# EAGLE design pcf1306p-SMD (EAGLE 6.5.0)
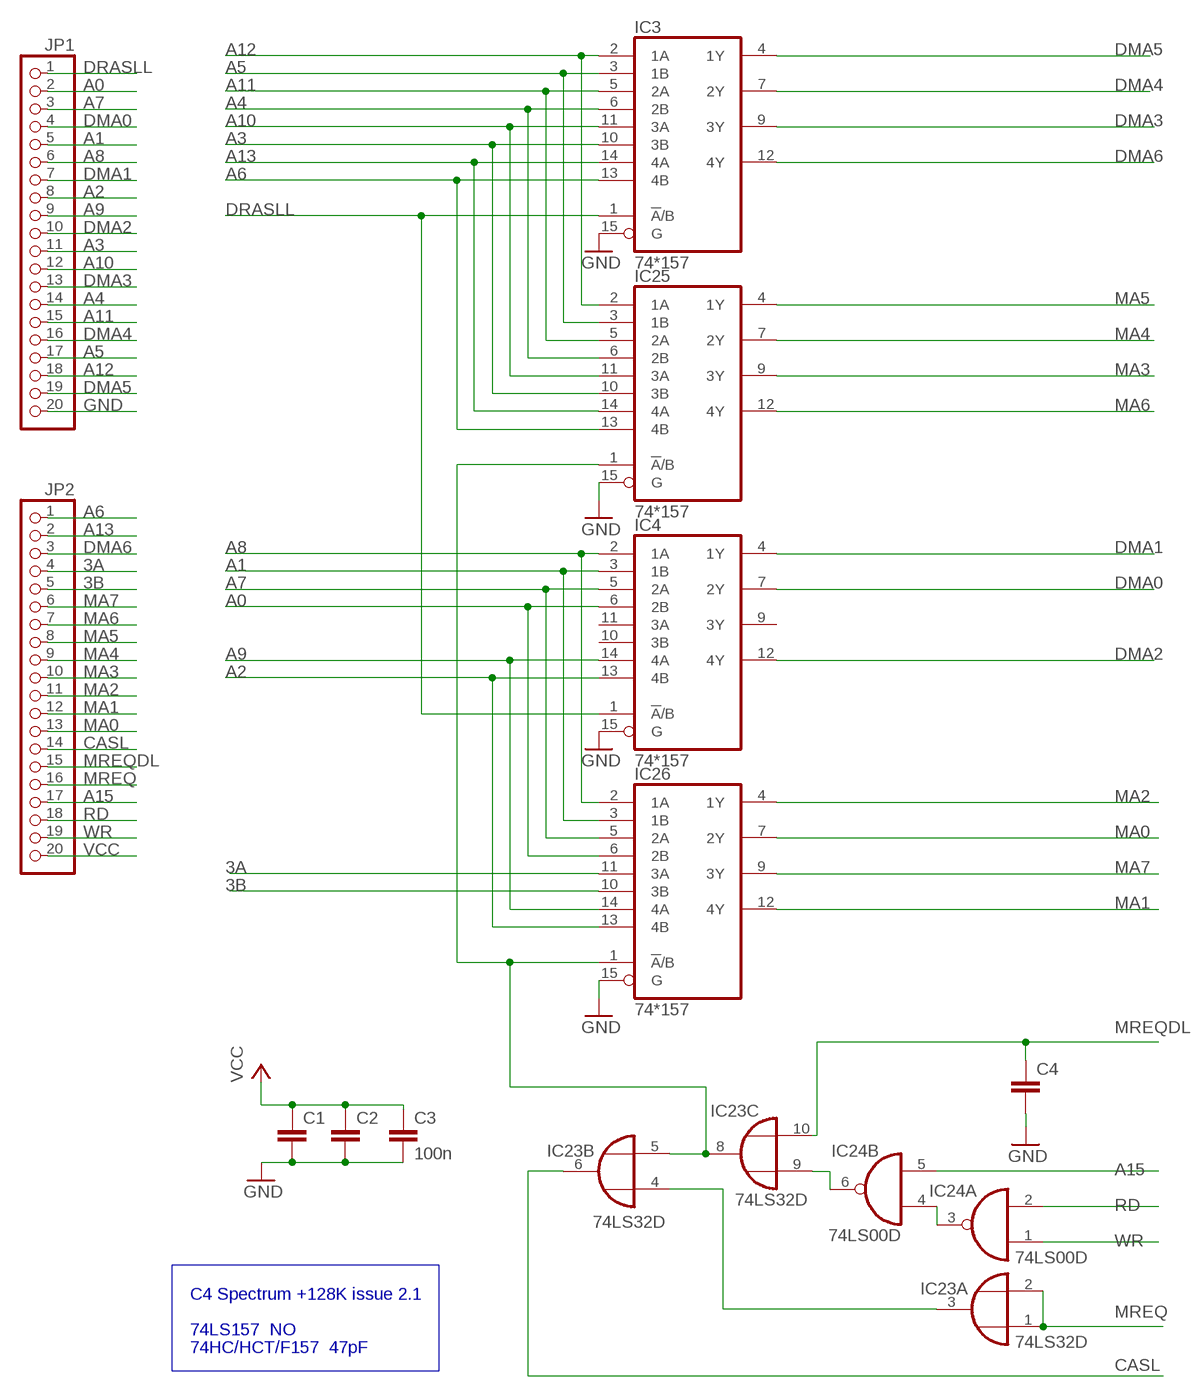
[diagram p0: schematic, sheet 1]

## Parts
C1  C-EUC0603  [C0603]
C2  C-EUC0603  [C0603]
C3  100n  C-EUC0603  [C0603]
C4  C-EUC0805  [C0805]
IC3  74*157  74LS157D  [SO16]
IC4  74*157  74LS157D  [SO16]
IC23  74LS32D  [SO14]
IC24  74LS00D  [SO14]
IC25  74*157  74LS157D  [SO16]
IC26  74*157  74LS157D  [SO16]
JP1  PINHD-1X20  [1X20]
JP2  PINHD-1X20  [1X20]

## Nets
3A: IC26.11(3A) JP2.4
3B: IC26.10(3B) JP2.5
A0: IC4.6(2B) IC26.6(2B) JP1.2
A1: IC4.3(1B) IC26.3(1B) JP1.5
A2: IC4.13(4B) IC26.13(4B) JP1.8
A3: IC3.10(3B) IC25.10(3B) JP1.11
A4: IC3.6(2B) IC25.6(2B) JP1.14
A5: IC3.3(1B) IC25.3(1B) JP1.17
A6: IC3.13(4B) IC25.13(4B) JP2.1
A7: IC4.5(2A) IC26.5(2A) JP1.3
A8: IC4.2(1A) IC26.2(1A) JP1.6
A9: IC4.14(4A) IC26.14(4A) JP1.9
A10: IC3.11(3A) IC25.11(3A) JP1.12
A11: IC3.5(2A) IC25.5(2A) JP1.15
A12: IC3.2(1A) IC25.2(1A) JP1.18
A13: IC3.14(4A) IC25.14(4A) JP2.2
A15: IC24.5(B:I1) JP2.17
CASL: IC23.6(B:O) JP2.14
DMA0: IC4.7(2Y) JP1.4
DMA1: IC4.4(1Y) JP1.7
DMA2: IC4.12(4Y) JP1.10
DMA3: IC3.9(3Y) JP1.13
DMA4: IC3.7(2Y) JP1.16
DMA5: IC3.4(1Y) JP1.19
DMA6: IC3.12(4Y) JP2.3
DRASLL: IC3.1(!A!/B) IC4.1(!A!/B) JP1.1
GND: C1.2 C2.2 C3.2 C4.2 IC3.15(G) IC4.15(G) IC25.15(G) IC26.15(G) JP1.20
MA0: IC26.7(2Y) JP2.13
MA1: IC26.12(4Y) JP2.12
MA2: IC26.4(1Y) JP2.11
MA3: IC25.9(3Y) JP2.10
MA4: IC25.7(2Y) JP2.9
MA5: IC25.4(1Y) JP2.8
MA6: IC25.12(4Y) JP2.7
MA7: IC26.9(3Y) JP2.6
MREQ: IC23.1(A:I0) IC23.2(A:I1) JP2.16
MREQDL: C4.1 IC23.10(C:I1) JP2.15
N$3: IC23.3(A:O) IC23.4(B:I0)
N$4: IC23.5(B:I1) IC23.8(C:O) IC25.1(!A!/B) IC26.1(!A!/B)
N$7: IC24.3(A:O) IC24.4(B:I0)
N$8: IC23.9(C:I0) IC24.6(B:O)
RD: IC24.2(A:I1) JP2.18
VCC: C1.1 C2.1 C3.1 JP2.20
WR: IC24.1(A:I0) JP2.19
Unconnected: IC4.9(3Y) IC4.10(3B) IC4.11(3A) IC23.11(D:O) IC23.12(D:I0) IC23.13(D:I1) IC24.8(C:O) IC24.9(C:I0) IC24.10(C:I1) IC24.11(D:O) IC24.12(D:I0) IC24.13(D:I1)

## Buses
B$1

## Notes on the sheet
- C4 Spectrum +128K issue 2.1
- 74LS157  NO
- 74HC/HCT/F157  47pF

## Power pins joined to a net without a drawn wire
GND: IC3.8(GND) IC4.8(GND) IC23.7(P:GND) IC24.7(P:GND) IC25.8(GND) IC26.8(GND)
VCC: IC3.16(VCC) IC4.16(VCC) IC23.14(P:VCC) IC24.14(P:VCC) IC25.16(VCC) IC26.16(VCC)

## Library data of the parts
C1-C4 = rcl:C-EU: CAPACITOR, European symbol
IC3 IC4 IC25 IC26 = 74xx-eu:74*157: Quadruple 2-line to 1-line data SELECTOR/MULTIPLEXER
IC23 = 74xx-eu:74*32: Quad 2-input OR gate
IC24 = 74xx-eu:74*00: Quad 2-input NAND gate
JP1 JP2 = pinhead:PINHD-1X20: PIN HEADER

## Board
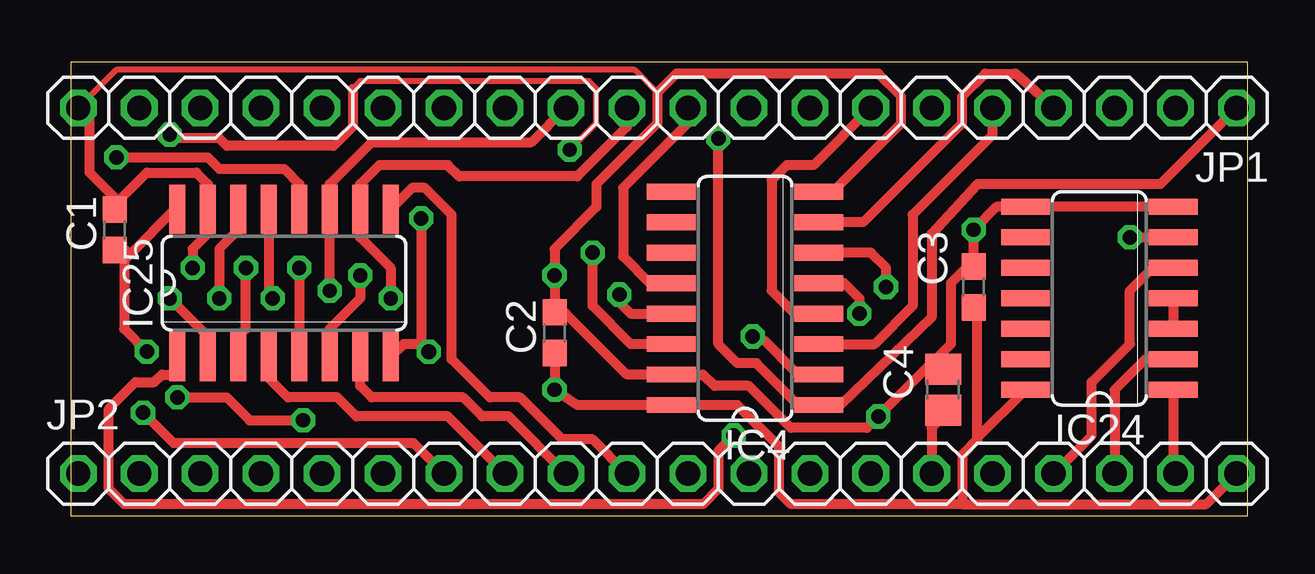
[diagram p1: board, top side]
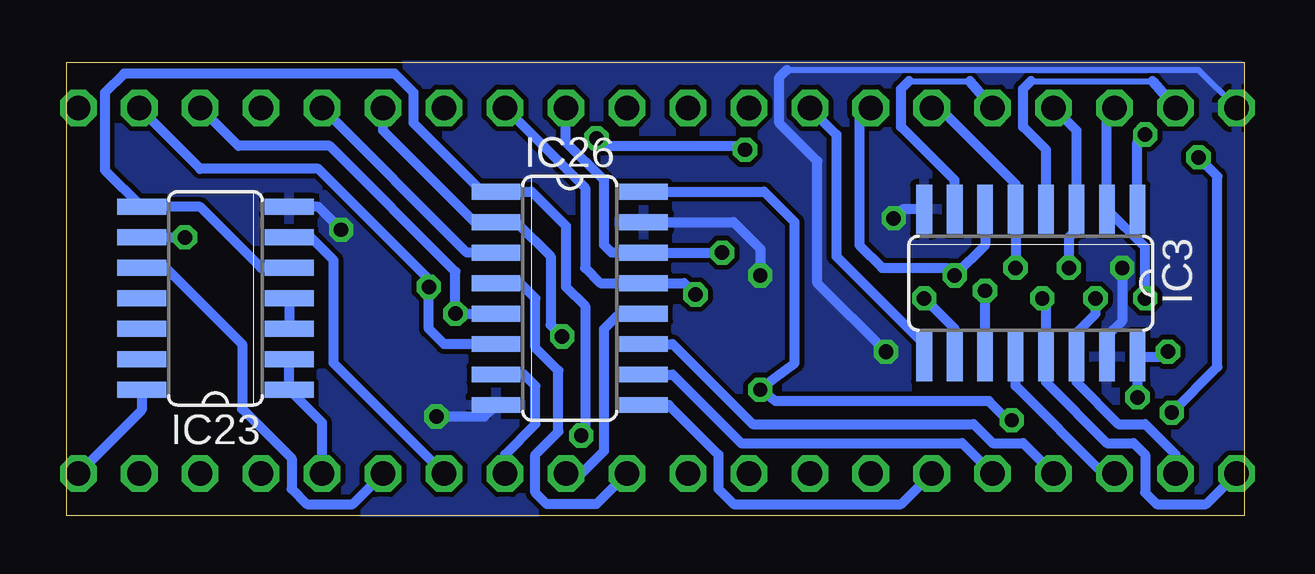
[diagram p2: board, bottom side, seen from below]

No outline drawn. Coordinates in mm, seen from the top.
Copper layers (1*16): Top 0.035mm / dielectric 1.5mm / Bottom 0.035mm
Design rules "default": minimum track width 10mil, minimum drill 24mil, track to track 8mil, track to pad 8mil, pad to pad 8mil, via to via 8mil, smd to smd 8mil, copper to edge 40mil, drill to drill 8mil, minimum pad ring 10mil, minimum via ring 8mil, stop-mask expansion 4mil, vias tented up to drill 0mil, thermal gap 10mil
Milling: 4 lines

### Footprints (pad centres in the part's own frame; a part is rotated, then mirrored left to right if it is on the bottom)
C0603 = smd 1.1 x 1: 1 -0.85,0; 2 0.85,0
C0805 = smd 1.3 x 1.5: 1 -0.85,0; 2 0.85,0
SO16 = smd 0.66 x 2.032: 1 -4.445,-3.073; 2 -3.175,-3.073; 3 -1.905,-3.073; 4 -0.635,-3.073; 5 0.635,-3.073; 6 1.905,-3.073; 7 3.175,-3.073; 8 4.445,-3.073; 9 4.445,3.073; 10 3.175,3.073; 11 1.905,3.073; 12 0.635,3.073; 13 -0.635,3.073; 14 -1.905,3.073; 15 -3.175,3.073; 16 -4.445,3.073
SO14 = smd 0.66 x 2.032: 1 -3.81,-3.073; 2 -2.54,-3.073; 3 -1.27,-3.073; 4 0,-3.073; 5 1.27,-3.073; 6 2.54,-3.073; 7 3.81,-3.073; 8 3.81,3.073; 9 2.54,3.073; 10 1.27,3.073; 11 0,3.073; 12 -1.27,3.073; 13 -2.54,3.073; 14 -3.81,3.073
1X20 = drill 1.016 octagon: 1 -24.13,0; 2 -21.59,0; 3 -19.05,0; 4 -16.51,0; 5 -13.97,0; 6 -11.43,0; 7 -8.89,0; 8 -6.35,0; 9 -3.81,0; 10 -1.27,0; 11 1.27,0; 12 3.81,0; 13 6.35,0; 14 8.89,0; 15 11.43,0; 16 13.97,0; 17 16.51,0; 18 19.05,0; 19 21.59,0; 20 24.13,0

### Placement (x,y rotation side)
C1  1.84,11.91 90 top
C2  20.16,7.62 90 top
C3  37.62,9.53 90 top
C4  36.35,5.24 90 top
IC3  8.89,9.68 180 bottom
IC4  28.1,9.05 90 top
IC23  42.86,9.05 90 bottom
IC24  42.86,9.05 90 top
IC25  8.89,9.68 0 top
IC26  28.1,9.05 270 bottom
JP1  24.45,16.99 180 top
JP2  24.45,1.75 0 top

### Tracks (layer width: path | path; a pad name or v marks a point on that pad's centre or on a via)
3A
  Bottom 0.406: IC26.11 23.81,7.14 20.48,3.81 11.27,3.81 10.48,3.02 9.21,3.02 JP2.4
3B
  Bottom 0.406: IC26.10 23.81,5.87 20.95,3.02 11.75,3.02 JP2.5
A0  (via drill 0.6)
  Top 0.406: v33.97,9.53 33.97,10.32 33.34,10.95 IC4.6
  Bottom 0.406: IC26.6 33.34,7.14 33.97,7.78 v33.97,9.53 33.97,9.84 38.58,14.45 43.5,14.45 JP1.2
A1
  Top 0.406: IC4.3 33.5,7.14 35.08,8.73 35.08,12.54 38.42,15.88 JP1.5
  Bottom 0.406: IC26.3 32.38,10.95 JP1.5
A2  (via drill 0.6)
  Top 0.406: v22.86,9.21 22.86,8.89 23.34,8.41 IC4.13
  Bottom 0.406: JP1.8 27.46,13.65 27.46,10.32 26.83,9.68 IC26.13 23.34,9.68 v22.86,9.21
A3  (via drill 0.6)
  Top 0.406: v13.34,9.05 13.34,10.32 12.06,11.59 IC25.10 12.06,13.81 12.86,14.61 15.72,14.61 16.19,14.13 21.11,14.13 23.18,16.19 JP1.11
  Bottom 0.406: v13.34,9.05 12.06,7.78 IC3.10
A4  (via drill 0.6)
  Top 0.406: v12.06,10 12.06,9.05 10.79,7.78 IC25.6
  Bottom 0.406: IC3.6 10.79,11.27 v12.06,10 12.38,10.32 15.08,10.32 16.03,11.27 16.03,16.51 JP1.14
A5  (via drill 0.6)
  Top 0.406: IC25.3 6.99,7.46 7.3,7.78 v7.3,10.32
  Bottom 0.406: v7.3,10.32 7.3,11.59 6.99,11.91 IC3.3 6.99,16.03 JP1.17
A6  (via drill 0.6)
  Top 0.406: IC25.13 8.26,9.21 v8.41,9.05
  Bottom 0.406: v8.41,9.05 8.26,8.89 IC3.13 8.26,5.56 5.71,3.02 4.6,3.02 4.13,2.54 4.13,0.95 3.65,0.48 1.59,0.48 JP2.1
A7  (via drill 0.6)
  Top 0.406: IC4.5 32.23,9.68 32.86,9.05 v32.86,8.41
  Bottom 0.406: JP1.3 41.91,15.4 38.1,15.4 32.86,10.16 v32.86,8.41 IC26.5
A8  (via drill 0.6)
  Top 0.406: IC4.2 30.32,5.87 28.89,7.3 28.57,7.3 v28.42,7.46
  Bottom 0.406: JP1.6 35.88,16.03 32.07,12.22 IC26.2 30.32,12.22 28.89,10.79 28.89,7.94 v28.42,7.46
A9  (via drill 0.6)
  Top 0.406: IC4.14 23.34,7.14 21.75,8.73 v21.75,10.95
  Bottom 0.406: v21.75,10.95 IC26.14 26.35,10.95 26.67,11.27 26.67,13.97 28.26,15.56 JP1.9
A10  (via drill 0.6)
  Top 0.406: v10.79,9.37 IC25.11 10.79,13.81 12.54,15.56 19.21,15.56 JP1.12
  Bottom 0.406: IC3.11 v10.79,9.37
A11  (via drill 0.6)
  Top 0.406: v9.53,10.32 IC25.5
  Bottom 0.406: v9.53,10.32 IC3.5 9.53,13.81 12.7,16.99 JP1.15
A12  (via drill 0.6)
  Top 0.406: IC25.2 5.71,7.46 v4.13,9.05
  Bottom 0.406: v4.13,9.05 4.13,11.17 IC3.2 5.71,16.67 JP1.18
A13  (via drill 0.6)
  Top 0.406: IC25.14 6.99,11.91 6.19,11.11 v6.19,9.05
  Bottom 0.406: v6.19,9.05 6.19,8.41 6.99,7.62 IC3.14 6.99,5.56 5.24,3.81 4.13,3.81 2.86,2.54 JP2.2
A15
  Top 0.406: JP2.17 42.55,3.33 42.55,5.56 44.13,7.14 44.13,9.37 45.09,10.32 IC24.5
CASL
  Bottom 0.406: JP2.14 37.94,6.35 37.94,10.64 38.89,11.59 IC23.6
DMA0
  Top 0.406: JP1.4 39.37,18.41 38.1,18.41 37.15,17.46 37.15,16.35 33.02,12.22 IC4.7
DMA1
  Top 0.406: JP1.7 30.96,14.61 29.84,14.61 29.21,13.97 29.21,9.37 30.16,8.41 IC4.4
DMA2
  Top 0.406: JP1.10 25.72,16.35 23.02,13.65 23.02,10.79 24.13,9.68 IC4.12
DMA3
  Bottom 0.406: JP1.13 16.99,15.88 16.99,10.79 13.34,7.14 IC3.9
DMA4
  Bottom 0.254: 13.97,18.1 11.43,18.1
  Bottom 0.406: IC3.7 12.06,13.97 14.29,16.19 14.29,17.78 13.97,18.1 | 11.43,18.1 JP1.16
DMA5
  Bottom 0.254: 8.89,18.1 3.81,18.1
  Bottom 0.406: IC3.4 8.26,15.24 9.21,16.19 9.21,17.78 8.89,18.1 | 3.81,18.1 JP1.19
DMA6
  Bottom 0.406: JP2.3 5.87,1.75 9.53,5.4 IC3.12
DRASLL  (via drill 0.6)
  Top 0.254: 11.75,17.78 12.06,18.1 21.59,18.1 21.91,17.78 21.91,16.35 v20.8,15.24
  Top 0.406: JP1.1 45.4,13.81 37.78,13.81 35.88,11.75 35.88,8.26 32.07,4.6 IC4.1 30.32,4.6 28.57,6.35 27.78,6.35 26.99,7.14 v26.99,15.72 | 11.75,17.78 11.75,16.19 10.95,15.4 6.51,15.4 6.19,15.72 4.29,15.72 v4.13,15.88
  Bottom 0.406: IC3.1 4.45,15.56 v4.13,15.88 | v26.99,15.72 26.67,15.4 20.95,15.4 v20.8,15.24
GND  (via drill 0.6, 0.61)
  Top 0.254: 24.45,17.62 23.5,18.57 1.91,18.57 JP1.20
  Top 0.406: v5.08,10.32 5.08,11.11 5.71,11.75 IC25.15 5.71,13.81 5.24,14.29 3.17,14.29 1.84,12.95 C1.2 1.84,13.24 0.79,14.29 0.79,16.51 JP1.20 | C4.2 35.62,6.09 | 35.62,6.09 v33.66,4.13 33.18,3.65 30,3.65 28.26,5.4 26.83,5.4 26.35,5.87 IC4.15 23.18,5.87 20.64,8.41 20.22,8.41 C2.2 v20.16,10 20.16,11.11 21.91,12.86 21.91,13.81 24.45,16.35 24.45,17.62 25.24,18.41 33.66,18.41 34.61,17.46 34.61,16.35 31.75,13.49 IC4.8 | IC24.7 38.58,12.86 v37.62,11.91 C3.2 37.36,10.38 36.67,9.68 36.67,7.14 35.62,6.09 | v14.61,12.38 14.61,7.14 | 14.61,7.14 v14.92,6.83 | 14.61,7.14 13.87,7.14 IC25.8
  Bottom 0.254: 19.05,18.57 1.91,18.57 JP1.20
  Bottom 0.406: v5.08,10.32 5.08,8.1 5.71,7.46 IC3.15 | IC3.8 14.23,12.76 v14.61,12.38 | v33.66,4.13 31.65,4.13 IC26.8 | v37.62,11.91 38.58,12.86 IC23.7 | v14.92,6.83 17.78,9.68 17.78,14.76 19.37,16.35 19.37,18.26 19.05,18.57 | IC26.15 21.27,12.22 20.16,11.11 v20.16,10
  pour Bottom: 0.16,18.73 48.9,18.73 48.9,0.16 0.16,0.16 0.16,18.57
MA0
  Bottom 0.406: JP2.13 30.8,2.54 29.53,3.81 29.53,5.4 30,5.87 IC26.7
MA1
  Bottom 0.406: IC26.12 26.04,8.41 26.67,7.78 26.67,2.7 27.62,1.75 JP2.12
MA2
  Bottom 0.406: JP2.11 26.99,0.48 29.05,0.48 29.53,0.95 29.53,2.54 28.57,3.49 28.57,6.03 29.53,6.99 29.53,9.05 30.16,9.68 IC26.4
MA3
  Top 0.406: JP2.10 21.75,3.17 20.48,3.17 18.73,4.92 17.46,4.92 15.88,6.51 15.88,12.54 14.76,13.65 14.23,13.65 IC25.9
MA4
  Top 0.406: JP2.9 18.26,4.13 17.14,4.13 16.35,4.92 12.54,4.92 12.06,5.4 IC25.7
MA5
  Top 0.406: IC25.4 8.26,5.71 9.05,4.92 11.11,4.92 11.91,4.13 15.72,4.13 JP2.8
MA6  (via drill 0.6)
  Top 0.406: v3.02,4.29 4.29,3.02 14.29,3.02 JP2.7 | v1.91,14.92 5.71,14.92 6.19,14.45 8.89,14.45 9.53,13.81 IC25.12
  Bottom 0.406: v3.02,4.29 1.11,6.19 1.11,14.13 v1.91,14.92
MA7
  Bottom 0.406: IC26.9 23.97,4.6 21.91,2.54 21.91,1.11 21.27,0.48 14.29,0.48 JP2.6
MREQ
  Bottom 0.406: IC23.2 IC23.1 38.42,3.87 JP2.16
MREQDL
  Top 0.406: C4.1 36.35,4.13 35.88,3.65 JP2.15
  Bottom 0.406: IC23.10 44.93,10.32 41.75,7.14 41.75,4.45 39.69,2.38 39.69,1.11 39.05,0.48 37.15,0.48 JP2.15
N$3
  Bottom 0.406: IC23.4 IC23.3
N$4  (via drill 0.6)
  Top 0.406: v27.62,3.33 26.99,2.7 26.99,1.11 26.35,0.48 2.22,0.48 1.59,1.11 1.59,4.45 2.7,5.56 3.49,5.56 3.81,5.87 4.29,5.87 4.45,6.03 IC25.1
  Bottom 0.406: IC23.5 40.96,10.32 43.5,12.86 IC23.8 47.47,14.39 47.47,17.62 46.67,18.41 35.4,18.41 34.61,17.62 34.61,16.35 31.75,13.49 IC26.1 29.69,13.49 28.26,12.06 28.26,9.53 27.46,8.73 27.46,3.49 v27.62,3.33
N$7
  Top 0.406: IC24.4 IC24.3
N$8  (via drill 0.6)
  Top 0.406: v44.13,11.59 IC24.6
  Bottom 0.406: IC24.6 v44.13,11.59
RD
  Top 0.406: IC24.2 44.77,6.51 43.5,5.24 JP2.18
VCC  (via drill 0.6)
  Top 0.406: 37.15,0.48 37.15,2.54 37.78,3.17 37.78,3.23 | 37.15,0.48 47.31,0.48 JP2.20 | IC25.16 4.34,12.76 2.46,10.87 | 2.46,10.87 2.22,10.64 2.22,7.78 v3.17,6.83 | C1.1 2.28,11.06 2.46,10.87 | 37.78,3.23 37.78,8.52 C3.1 | 37.78,3.23 IC24.14 | 37.15,0.48 30,0.48 29.53,0.95 29.53,2.86 27.78,4.6 IC4.16 21.11,4.6 v20.16,5.24 C2.1 | v4.45,4.92 6.51,4.92 7.46,3.97 v9.68,3.97
  Bottom 0.406: IC23.14 45.94,4.39 JP2.20 | v3.17,6.83 3.39,6.61 IC3.16 v4.45,4.92 | IC26.16 20,13.49 18.73,12.22 18.73,6.35 20,5.4 v20.16,5.24 19.53,4.76 10.64,4.76 9.84,3.97 v9.68,3.97
WR
  Top 0.254: JP2.19 45.94,1.75
  Top 0.406: IC24.1 45.94,1.75